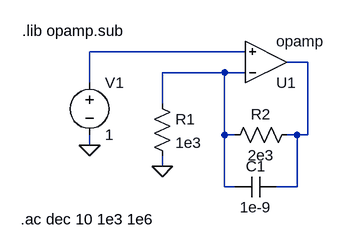
[diagram p0: schematic Draft1.asc]
Draft1.asc, the LTspice schematic file:
Version 4
SHEET 1 880 680
WIRE 256 128 16 128
WIRE 352 144 320 144
WIRE 224 160 128 160
WIRE 256 160 224 160
WIRE 16 176 16 128
WIRE 128 208 128 160
WIRE 224 256 224 160
WIRE 240 256 224 256
WIRE 336 256 320 256
WIRE 352 256 352 144
WIRE 352 256 336 256
WIRE 16 272 16 256
WIRE 128 304 128 288
WIRE 224 336 224 256
WIRE 240 336 224 336
WIRE 336 336 336 256
WIRE 336 336 304 336
FLAG 128 304 0
FLAG 16 272 0
SYMBOL OpAmps\\opamp 288 208 M180
SYMATTR InstName U1
SYMBOL res 112 192 R0
SYMATTR InstName R1
SYMATTR Value 1e3
SYMBOL res 336 240 R90
WINDOW 0 0 56 VBottom 2
WINDOW 3 32 56 VTop 2
SYMATTR InstName R2
SYMATTR Value 2e3
SYMBOL cap 304 320 R90
WINDOW 0 0 32 VBottom 2
WINDOW 3 32 32 VTop 2
SYMATTR InstName C1
SYMATTR Value 1e-9
SYMBOL voltage 16 160 R0
WINDOW 39 0 0 Left 0
SYMATTR InstName V1
SYMATTR Value 1
SYMATTR Value2 AC 1
TEXT -88 96 Left 2 !.lib opamp.sub
TEXT -90 386 Left 2 !.ac dec 10 1e3 1e6

The netlist it stands for:
* Draft1.asc
XU1 N003 N001 N002 opamp Aol=100K GBW=10Meg  ; pins invin noninvin out
R1 N003 0 1e3
R2 N002 N003 2e3
C1 N002 N003 1e-9
V1 N001 0 1 AC 1
.lib opamp.sub
.ac dec 10 1e3 1e6
.backanno
.end